# EasyEDA Pro project ProPrj_基于STM32的多功能串口分析仪_2025-03-12.epro, schematic Schematic2
Board Name: 烧录转接; Create Date: 2025-01-18; Page Name: P1; Project Name: 基于STM32的多功能串口分析仪; Schematic Name: Schematic2; Update Date: 2025-01-18; Company: 嘉立创EDA; Page Size: A4; Version: V1.0
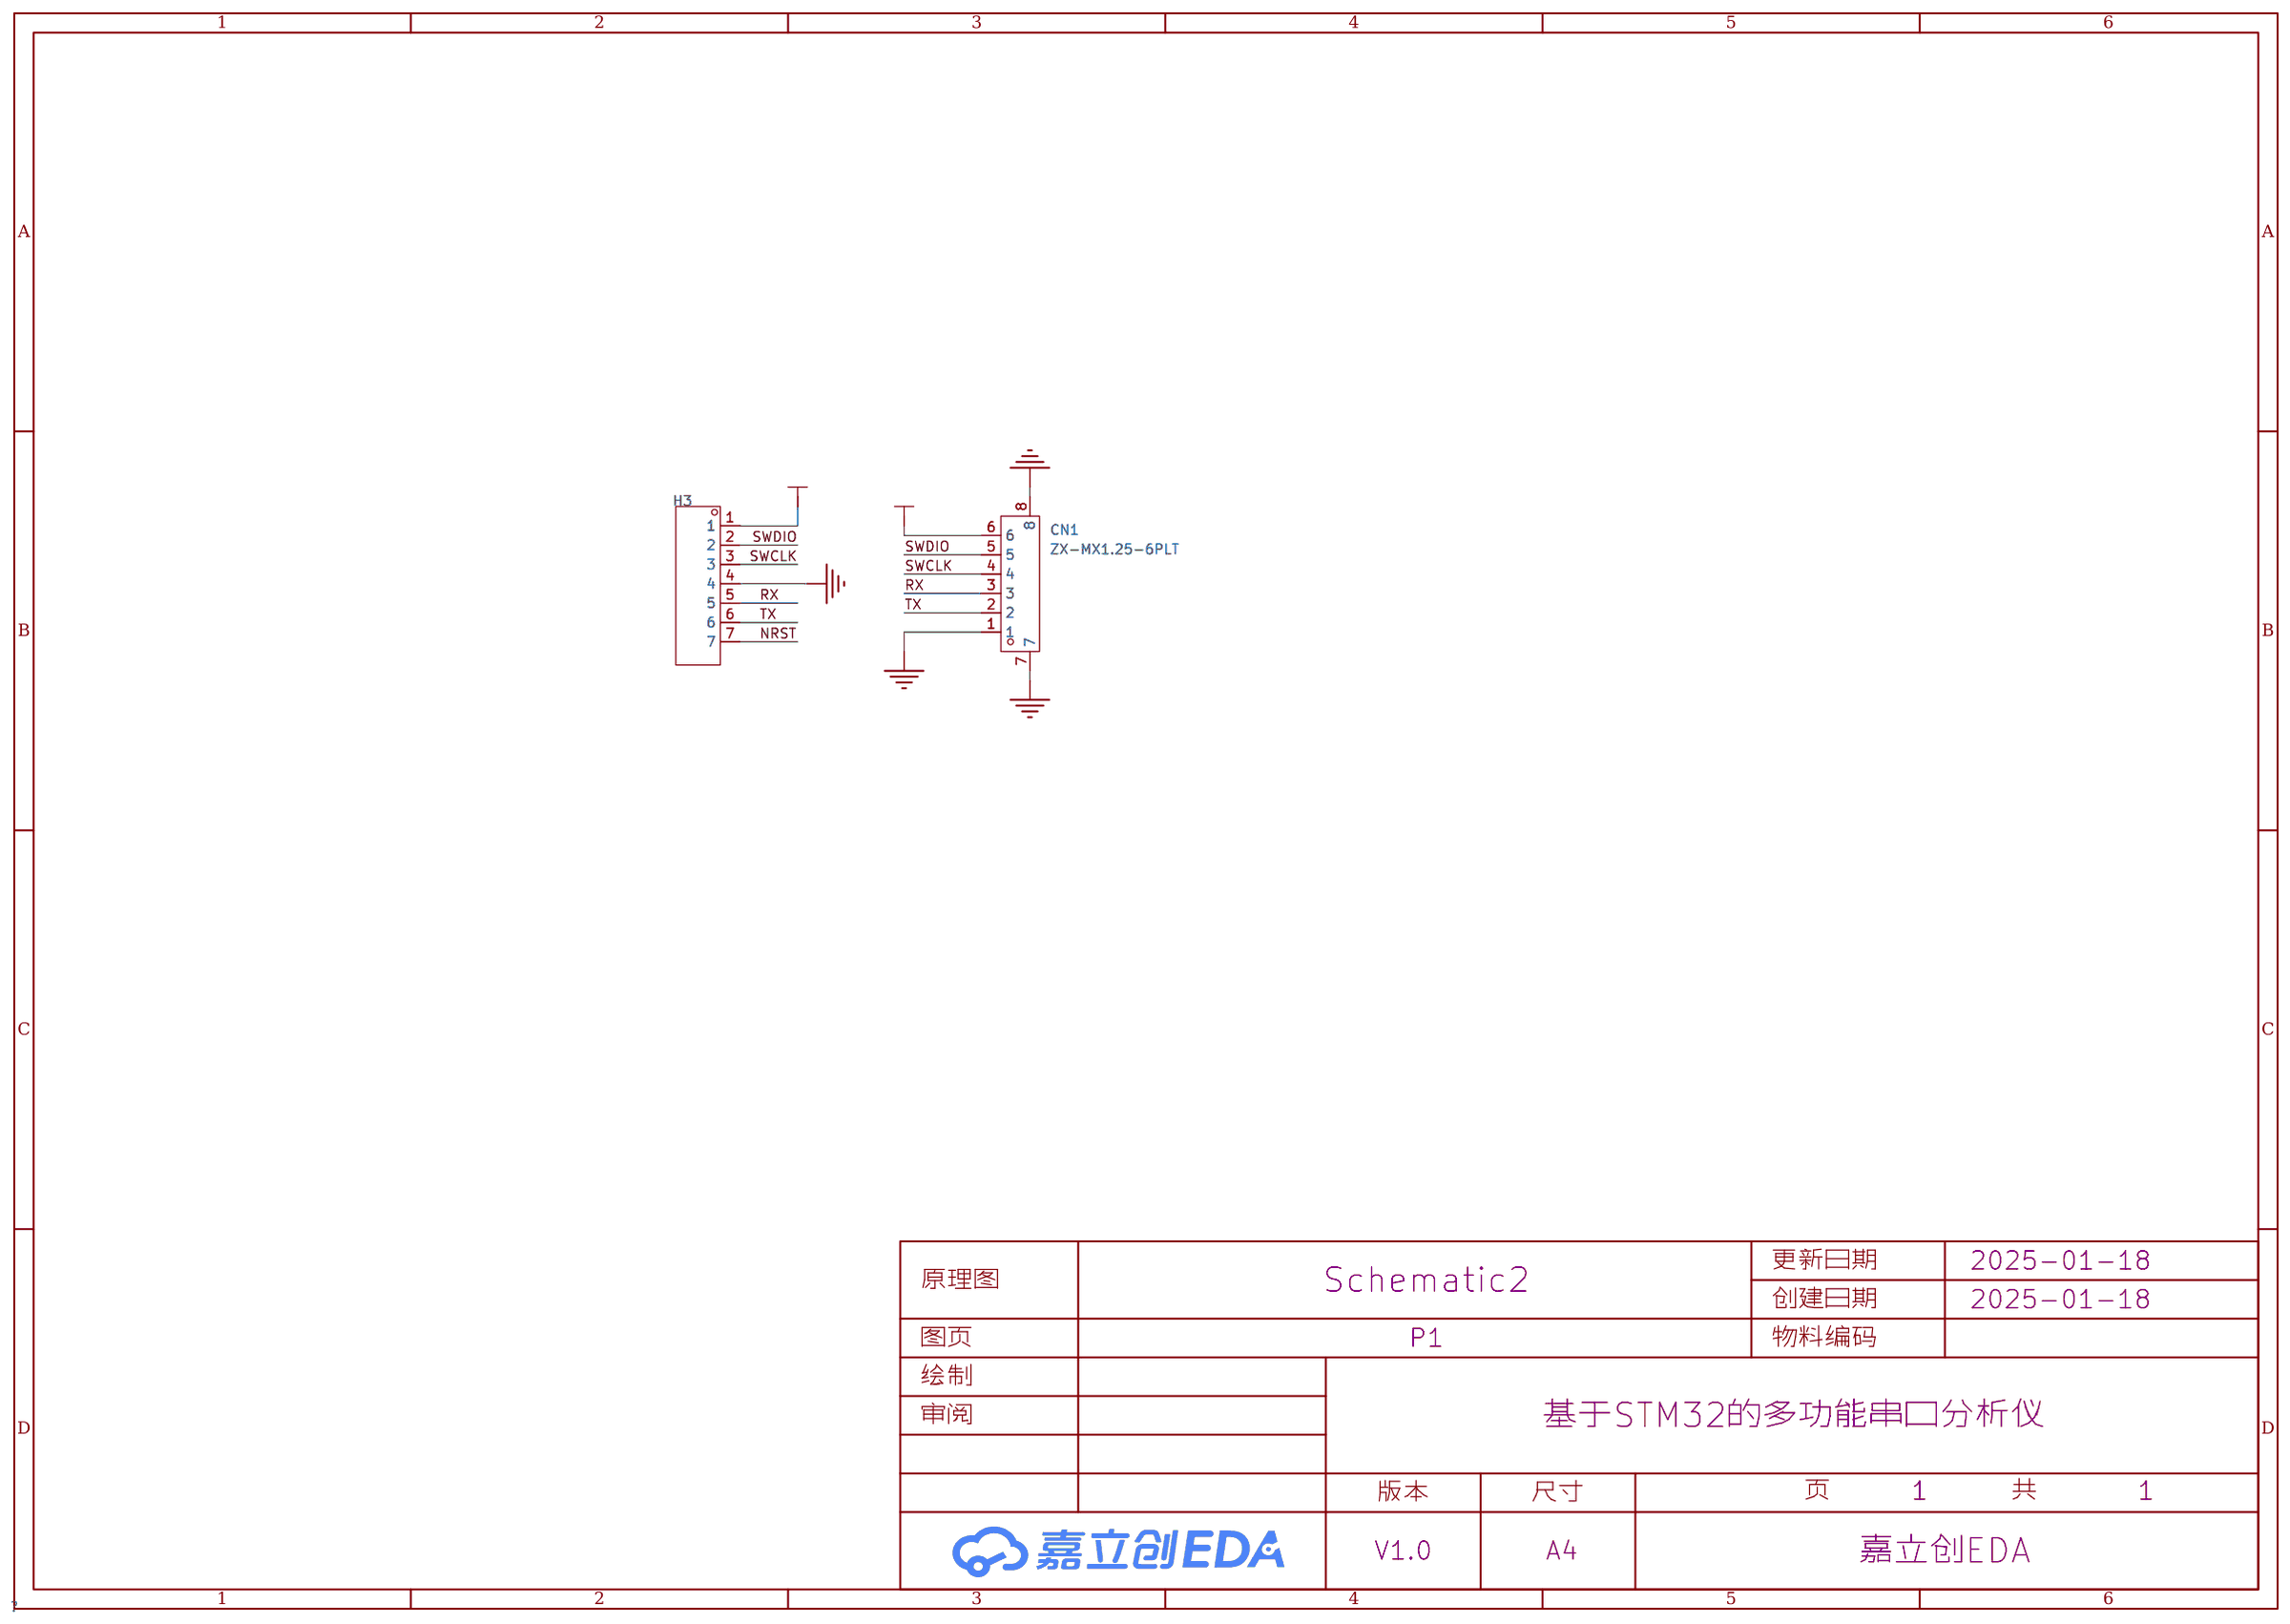
[diagram p6: schematic sheet]

## Parts
CN1  ZX-MX1.25-6PLT  [CONN-SMD_6P-P1.25_ZX-MX1.25-6PLT]
H3  -  [HDR-TH_7P-P2.54-V-F]

## Library data of the parts
CN1 = ZX-MX1.25-6PLT: 插针结构:1x6P;间距:1.25mm;安装方式:立贴;参考系列:PicoBlade(MX 1.25);总PIN数:6P;排数:1;每排PIN数:6;行距:-;额定电流:-;触头材质:黄铜;触头镀层:锡;工作温度范围:-;; LCSC Part Name: 1x6P 间距:1.25mm 立贴 系列:PicoBlade(MX 1.25) 配套胶壳型号：ZX-MX1.25-6PJK 配套端子型号：ZX-MX1.25-DZ 配套杜邦线型号：ZX-MX1.25-6PBXC; Supplier Part: C7430477; Manufacturer: Megastar(兆星); Supplier Footprint: SMD,P=1.25mm; JLCPCB Part Class: 扩展库; Datasheet: https://atta.szlcsc.com/upload/public/pdf/source/20230619/DB53D684825F7F3C14553A5733A46FF1.pdf; Supplier: LCSC; Pins Structure: 1x6P; Pitch: 1.25mm; Mounting Style: 立贴; Reference Series: PicoBlade(MX 1.25); Number of Pins: 6P; Number of Rows: 1; Number of PINs Per Row: 6; Contact Material: 黄铜; Contact Plating: 锡; Supplementary Features: 辅助焊脚; Colour: 米色; Z-Height of the Board: 4.7mm; X-Length of Bottom Edge on Board (Spacing Line): 12.5mm; Y-Width of Bottom Edge on Board: 4.4mm
H3 = HDR-F_2.54_1x7P: Supplier Part: C124418; Supplier Footprint: 插件

## Nets
GND: CN1.1 CN1.7 CN1.8 H3.4
M3.3V: CN1.6 H3.1
NRST: H3.7
RX: CN1.3 H3.5
SWCLK: CN1.4 H3.3
SWDIO: CN1.5 H3.2
TX: CN1.2 H3.6
